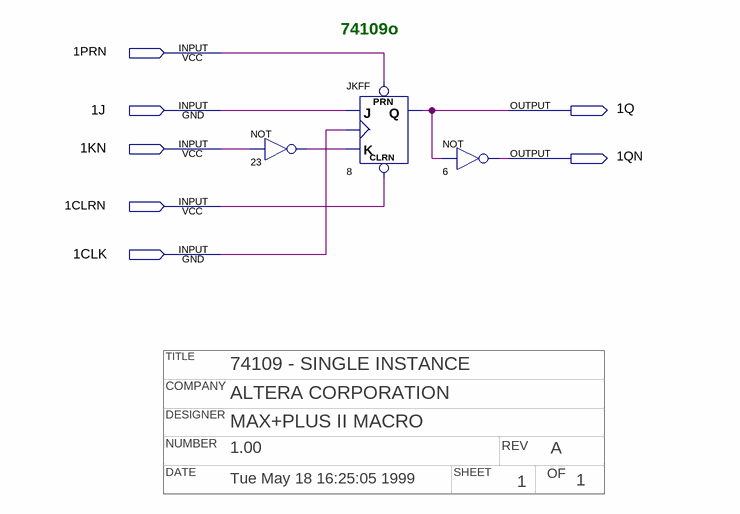
[diagram p0: schematic sheet]
// Quartus schematic 74109o.bdf as structural Verilog: 3 symbols, 7 pins
// Title block: TITLE: 74109 - SINGLE INSTANCE; COMPANY: ALTERA CORPORATION; DESIGNER: MAX+PLUS II MACRO; NUMBER: 1.00; REV: A; DATE: Tue May 18 16:25:05 1999; SHEET: 1; OF: 1
module \74109o  (
  input  \1PRN ,
  input  \1J ,
  input  \1KN ,
  input  \1CLRN ,
  input  \1CLK ,
  output \1Q ,
  output \1QN 
);

  wire n23_out;

  not u_23 (n23_out, \1KN );
  JKFF u_8 (.PRN(\1PRN ), .CLRN(\1CLRN ), .K(n23_out), .J(\1J ), .CLK(\1CLK ), .Q(\1Q ));
  not u_6 (\1QN , \1Q );

  // Notes on the sheet:
  //   74109o
endmodule
